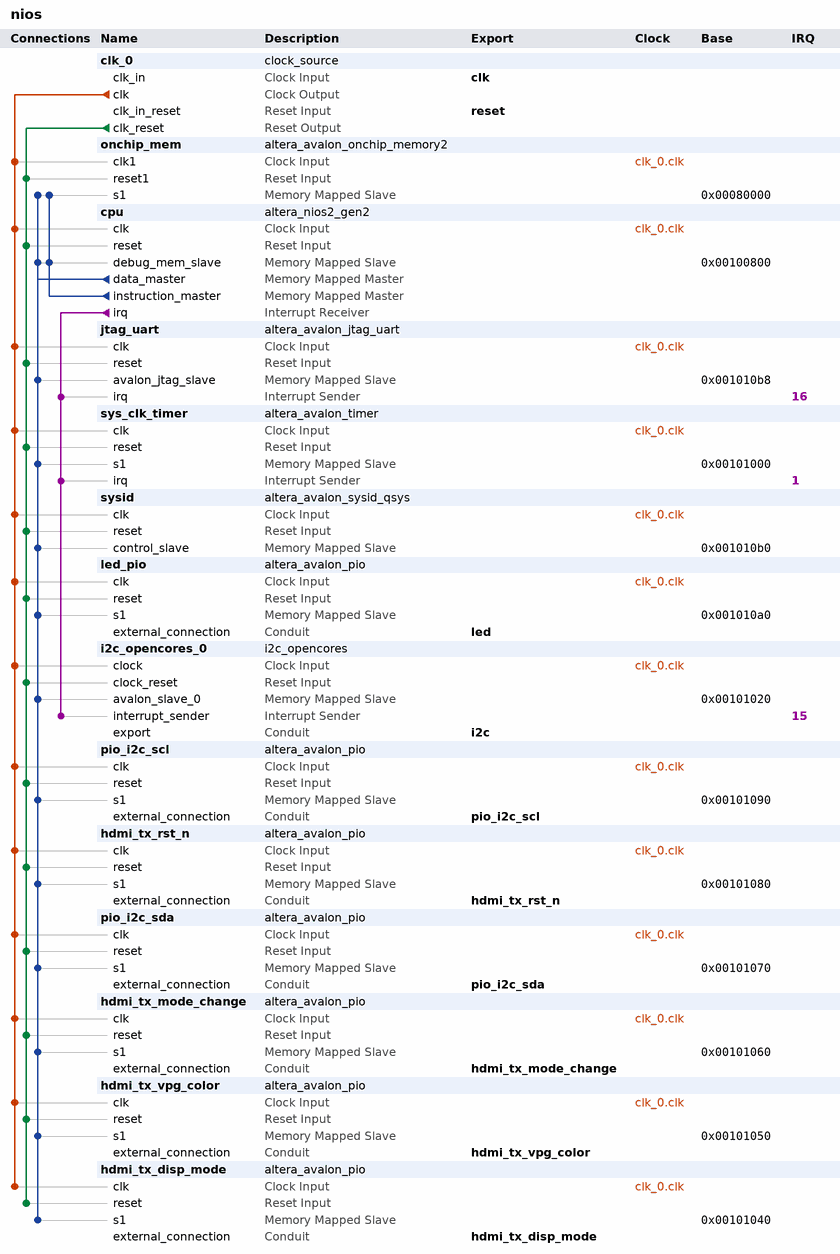
[diagram p0: system contents]
# Platform Designer (Qsys) system nios, Stratix V 5SGSMD5K2F40C2
# Parameters at their usual value, and those the tool derives, are not listed.
package require -exact qsys 17.0
create_system nios
set_project_property DEVICE_FAMILY {Stratix V}
set_project_property DEVICE 5SGSMD5K2F40C2

add_instance clk_0 clock_source 17.0
set_instance_parameter_value clk_0 clockFrequency 50000000

add_instance onchip_mem altera_avalon_onchip_memory2 17.0
set_instance_parameter_value onchip_mem dataWidth 32
set_instance_parameter_value onchip_mem dualPort false
set_instance_parameter_value onchip_mem initMemContent true
set_instance_parameter_value onchip_mem initializationFileName onchip_mem.hex
set_instance_parameter_value onchip_mem memorySize 327360

add_instance cpu altera_nios2_gen2 17.0
set_instance_parameter_value cpu dcache_size 0
set_instance_parameter_value cpu exceptionSlave onchip_mem.s1
set_instance_parameter_value cpu icache_size 8192
set_instance_parameter_value cpu impl Fast
set_instance_parameter_value cpu resetSlave onchip_mem.s1

add_instance jtag_uart altera_avalon_jtag_uart 17.0
set_instance_parameter_value jtag_uart simInteractiveOptions NO_INTERACTIVE_WINDOWS

add_instance sys_clk_timer altera_avalon_timer 17.0
set_instance_parameter_value sys_clk_timer period 1
set_instance_parameter_value sys_clk_timer periodUnits MSEC

add_instance sysid altera_avalon_sysid_qsys 17.0
set_instance_parameter_value sysid id 0

add_instance led_pio altera_avalon_pio 17.0
set_instance_parameter_value led_pio direction Output
set_instance_parameter_value led_pio width 8

add_instance i2c_opencores_0 i2c_opencores 13.0

add_instance pio_i2c_scl altera_avalon_pio 17.0
set_instance_parameter_value pio_i2c_scl direction Output
set_instance_parameter_value pio_i2c_scl width 1

add_instance hdmi_tx_rst_n altera_avalon_pio 17.0
set_instance_parameter_value hdmi_tx_rst_n direction Output
set_instance_parameter_value hdmi_tx_rst_n resetValue 1
set_instance_parameter_value hdmi_tx_rst_n width 1

add_instance pio_i2c_sda altera_avalon_pio 17.0
set_instance_parameter_value pio_i2c_sda direction Bidir
set_instance_parameter_value pio_i2c_sda width 1

add_instance hdmi_tx_mode_change altera_avalon_pio 17.0
set_instance_parameter_value hdmi_tx_mode_change direction Output
set_instance_parameter_value hdmi_tx_mode_change width 1

add_instance hdmi_tx_vpg_color altera_avalon_pio 17.0
set_instance_parameter_value hdmi_tx_vpg_color direction Output
set_instance_parameter_value hdmi_tx_vpg_color width 2

add_instance hdmi_tx_disp_mode altera_avalon_pio 17.0
set_instance_parameter_value hdmi_tx_disp_mode direction Output
set_instance_parameter_value hdmi_tx_disp_mode width 4

# connections
add_connection clk_0.clk cpu.clk clock
add_connection clk_0.clk hdmi_tx_disp_mode.clk clock
add_connection clk_0.clk hdmi_tx_mode_change.clk clock
add_connection clk_0.clk hdmi_tx_rst_n.clk clock
add_connection clk_0.clk hdmi_tx_vpg_color.clk clock
add_connection clk_0.clk i2c_opencores_0.clock clock
add_connection clk_0.clk jtag_uart.clk clock
add_connection clk_0.clk led_pio.clk clock
add_connection clk_0.clk onchip_mem.clk1 clock
add_connection clk_0.clk pio_i2c_scl.clk clock
add_connection clk_0.clk pio_i2c_sda.clk clock
add_connection clk_0.clk sys_clk_timer.clk clock
add_connection clk_0.clk sysid.clk clock
add_connection clk_0.clk_reset cpu.reset reset
add_connection clk_0.clk_reset hdmi_tx_disp_mode.reset reset
add_connection clk_0.clk_reset hdmi_tx_mode_change.reset reset
add_connection clk_0.clk_reset hdmi_tx_rst_n.reset reset
add_connection clk_0.clk_reset hdmi_tx_vpg_color.reset reset
add_connection clk_0.clk_reset i2c_opencores_0.clock_reset reset
add_connection clk_0.clk_reset jtag_uart.reset reset
add_connection clk_0.clk_reset led_pio.reset reset
add_connection clk_0.clk_reset onchip_mem.reset1 reset
add_connection clk_0.clk_reset pio_i2c_scl.reset reset
add_connection clk_0.clk_reset pio_i2c_sda.reset reset
add_connection clk_0.clk_reset sys_clk_timer.reset reset
add_connection clk_0.clk_reset sysid.reset reset
add_connection cpu.data_master cpu.debug_mem_slave avalon
set_connection_parameter_value cpu.data_master/cpu.debug_mem_slave baseAddress 0x00100800
add_connection cpu.data_master hdmi_tx_disp_mode.s1 avalon
set_connection_parameter_value cpu.data_master/hdmi_tx_disp_mode.s1 baseAddress 0x00101040
add_connection cpu.data_master hdmi_tx_mode_change.s1 avalon
set_connection_parameter_value cpu.data_master/hdmi_tx_mode_change.s1 baseAddress 0x00101060
add_connection cpu.data_master hdmi_tx_rst_n.s1 avalon
set_connection_parameter_value cpu.data_master/hdmi_tx_rst_n.s1 baseAddress 0x00101080
add_connection cpu.data_master hdmi_tx_vpg_color.s1 avalon
set_connection_parameter_value cpu.data_master/hdmi_tx_vpg_color.s1 baseAddress 0x00101050
add_connection cpu.data_master i2c_opencores_0.avalon_slave_0 avalon
set_connection_parameter_value cpu.data_master/i2c_opencores_0.avalon_slave_0 baseAddress 0x00101020
add_connection cpu.data_master jtag_uart.avalon_jtag_slave avalon
set_connection_parameter_value cpu.data_master/jtag_uart.avalon_jtag_slave baseAddress 0x001010b8
add_connection cpu.data_master led_pio.s1 avalon
set_connection_parameter_value cpu.data_master/led_pio.s1 baseAddress 0x001010a0
add_connection cpu.data_master onchip_mem.s1 avalon
set_connection_parameter_value cpu.data_master/onchip_mem.s1 baseAddress 0x00080000
add_connection cpu.data_master pio_i2c_scl.s1 avalon
set_connection_parameter_value cpu.data_master/pio_i2c_scl.s1 baseAddress 0x00101090
add_connection cpu.data_master pio_i2c_sda.s1 avalon
set_connection_parameter_value cpu.data_master/pio_i2c_sda.s1 baseAddress 0x00101070
add_connection cpu.data_master sys_clk_timer.s1 avalon
set_connection_parameter_value cpu.data_master/sys_clk_timer.s1 baseAddress 0x00101000
add_connection cpu.data_master sysid.control_slave avalon
set_connection_parameter_value cpu.data_master/sysid.control_slave baseAddress 0x001010b0
add_connection cpu.instruction_master cpu.debug_mem_slave avalon
set_connection_parameter_value cpu.instruction_master/cpu.debug_mem_slave baseAddress 0x00100800
add_connection cpu.instruction_master onchip_mem.s1 avalon
set_connection_parameter_value cpu.instruction_master/onchip_mem.s1 baseAddress 0x00080000
add_connection cpu.irq i2c_opencores_0.interrupt_sender interrupt
set_connection_parameter_value cpu.irq/i2c_opencores_0.interrupt_sender irqNumber 15
add_connection cpu.irq jtag_uart.irq interrupt
set_connection_parameter_value cpu.irq/jtag_uart.irq irqNumber 16
add_connection cpu.irq sys_clk_timer.irq interrupt
set_connection_parameter_value cpu.irq/sys_clk_timer.irq irqNumber 1

# exported interfaces
add_interface clk clock sink
set_interface_property clk EXPORT_OF clk_0.clk_in
add_interface hdmi_tx_disp_mode conduit end
set_interface_property hdmi_tx_disp_mode EXPORT_OF hdmi_tx_disp_mode.external_connection
add_interface hdmi_tx_mode_change conduit end
set_interface_property hdmi_tx_mode_change EXPORT_OF hdmi_tx_mode_change.external_connection
add_interface hdmi_tx_rst_n conduit end
set_interface_property hdmi_tx_rst_n EXPORT_OF hdmi_tx_rst_n.external_connection
add_interface hdmi_tx_vpg_color conduit end
set_interface_property hdmi_tx_vpg_color EXPORT_OF hdmi_tx_vpg_color.external_connection
add_interface i2c conduit end
set_interface_property i2c EXPORT_OF i2c_opencores_0.export
add_interface led conduit end
set_interface_property led EXPORT_OF led_pio.external_connection
add_interface pio_i2c_scl conduit end
set_interface_property pio_i2c_scl EXPORT_OF pio_i2c_scl.external_connection
add_interface pio_i2c_sda conduit end
set_interface_property pio_i2c_sda EXPORT_OF pio_i2c_sda.external_connection
add_interface reset reset sink
set_interface_property reset EXPORT_OF clk_0.clk_in_reset

set_interconnect_requirement {$system} qsys_mm.clockCrossingAdapter HANDSHAKE
set_interconnect_requirement {$system} qsys_mm.enableEccProtection FALSE
set_interconnect_requirement {$system} qsys_mm.insertDefaultSlave FALSE
set_interconnect_requirement {$system} qsys_mm.maxAdditionalLatency 1

save_system nios.qsys
